# EAGLE design Relay_PCB (EAGLE 9.0.1)
Relay1
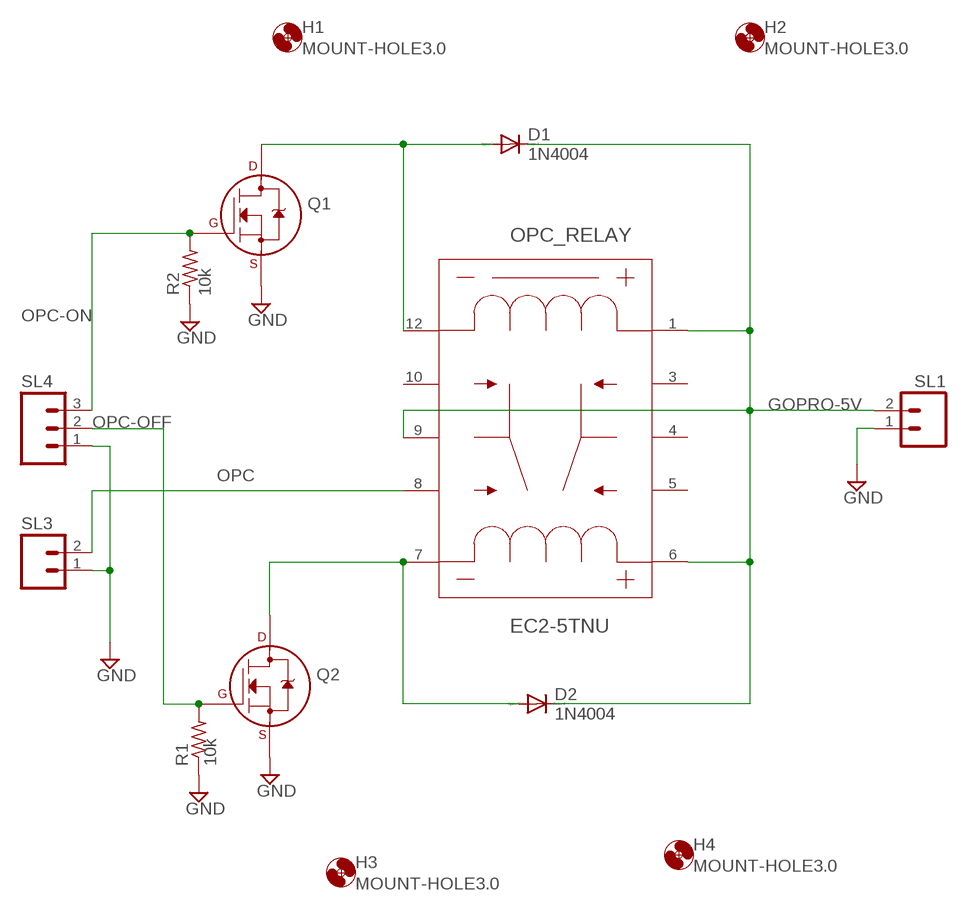
[diagram p0: schematic, sheet 1]

## Parts
D1  1N4004  [DO41-10]
D2  1N4004  [DO41-10]
H1  MOUNT-HOLE3.0  [3,0]
H2  MOUNT-HOLE3.0  [3,0]
H3  MOUNT-HOLE3.0  [3,0]
H4  MOUNT-HOLE3.0  [3,0]
OPC_RELAY  EC2-5TNU  [EC2TNU]
Q1  2N7000_TO92  [TO-92]
Q2  2N7000_TO92  [TO-92]
R1  R-US_0207/7  [0207/7]
R2  R-US_0207/7  [0207/7]
SL1  M02  [02P]
SL3  M02  [02P]
SL4  M03  [03P]

## Nets
GND [5V_Relay]: Q1.1(S) Q2.1(S) R1.1 R2.1 SL1.1 SL3.1 SL4.1
GOPRO-5V [5V_Relay]: D1.C D2.C OPC_RELAY.1 OPC_RELAY.6 OPC_RELAY.9 SL1.2
N$1 [5V_Relay]: D1.A OPC_RELAY.12 Q1.3(D)
N$3 [5V_Relay]: D2.A OPC_RELAY.7 Q2.3(D)
OPC [5V_Relay]: OPC_RELAY.8 SL3.2
OPC-OFF [5V_Relay]: Q2.2(G) R1.2 SL4.2
OPC-ON [5V_Relay]: Q1.2(G) R2.2 SL4.3
Unconnected: OPC_RELAY.3 OPC_RELAY.4 OPC_RELAY.5 OPC_RELAY.10

## Notes on the sheet
- 10k
- 10k

## Library data of the parts
D1 D2 = diode:1N4004: DIODE general purpose rectifier, 1 A
H1-H4 = holes:MOUNT-HOLE: MOUNTING HOLE with drill center marker
OPC_RELAY = EC2-5TNU:EC2-5TNU; MANUFACTURER_PART_NUMBER: EC25TNU; VENDOR: KEMET
Q1 Q2 = transistors:2N700*: 2N7000, 2N7002, NDS7002A N-channel enhancement mode MOSFET
R1 R2 = rcl:R-US_: RESISTOR, American symbol; SPICEPREFIX: R
SL1 SL3 = con-amp-quick:M02: AMP QUICK CONNECTOR; OC_FARNELL: unknown; OC_NEWARK: unknown
SL4 = con-amp-quick:M03: AMP QUICK CONNECTOR; OC_FARNELL: unknown; OC_NEWARK: unknown

## Net classes
1 5V_Relay: width 0.254 mm, drill 0.889 mm, clearance 0.127 mm

## Board
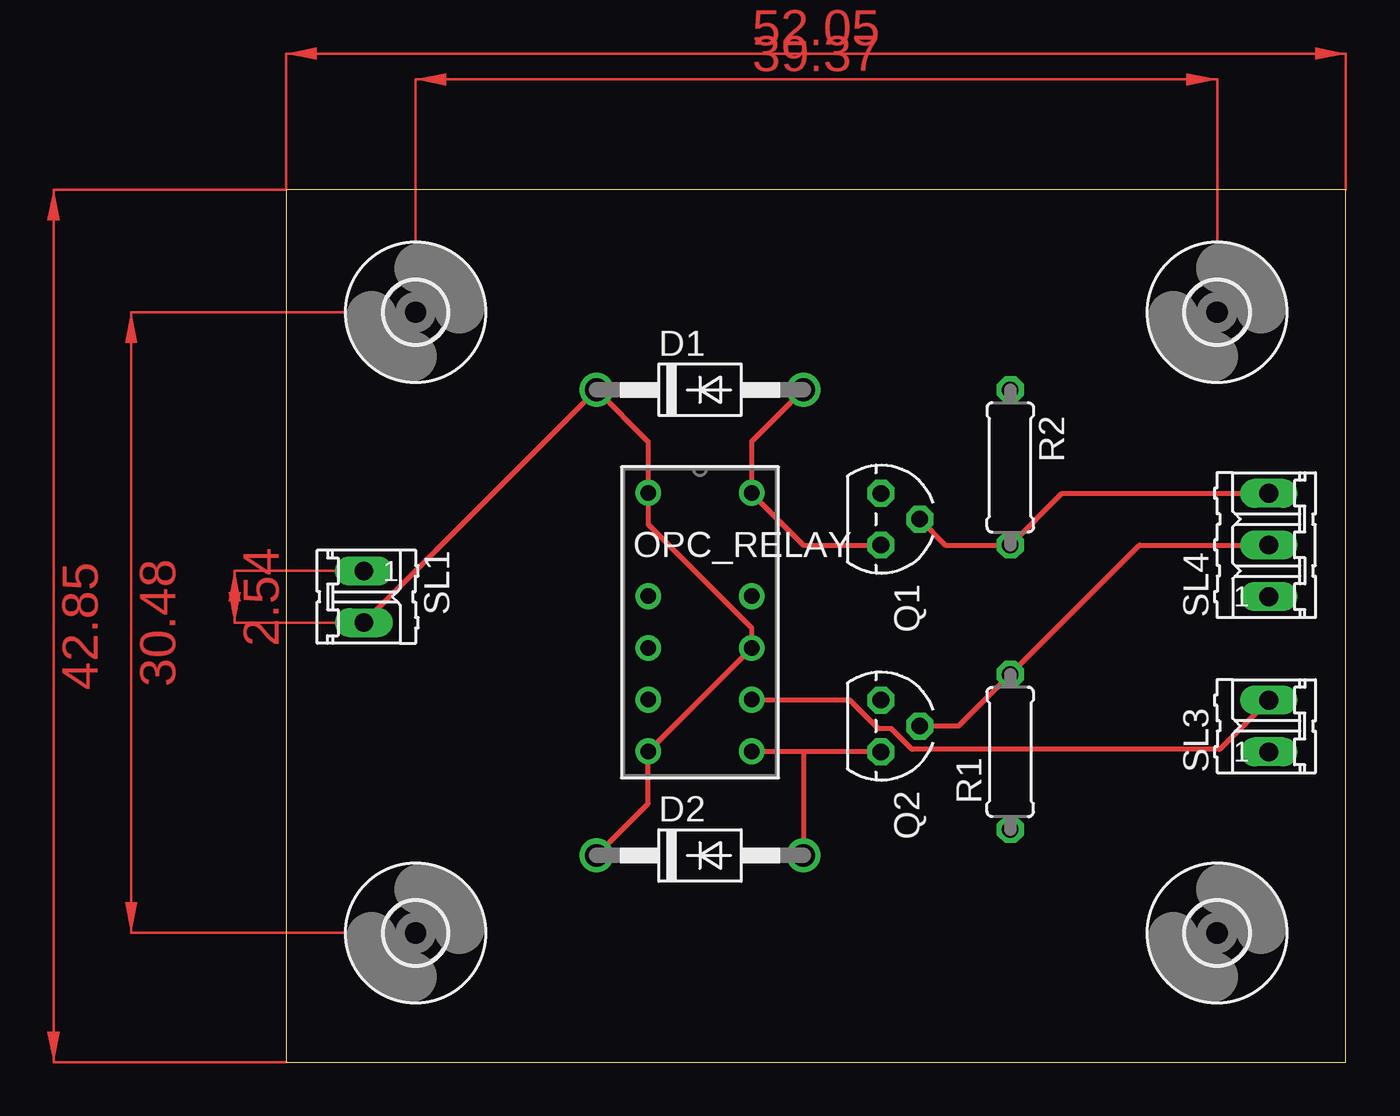
[diagram p1: board, top side]
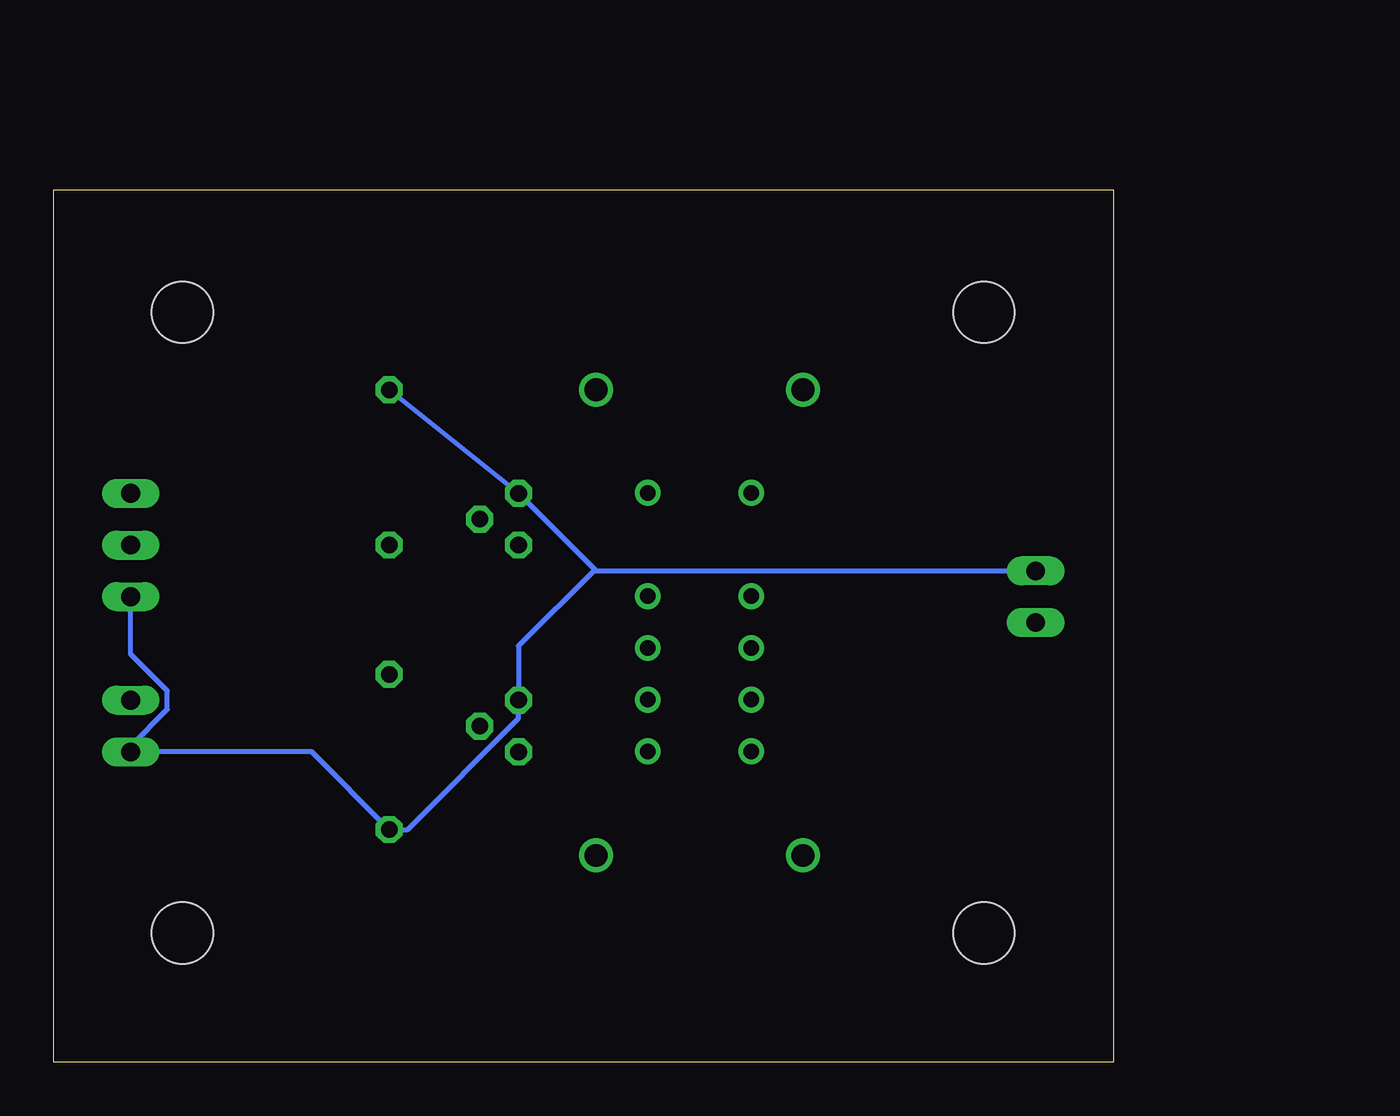
[diagram p2: board, bottom side, seen from below]

Size 52.05 x 42.85 mm. Coordinates in mm from the lower left corner, seen from the top.
Outline: 0,0 52.05,0 52.05,42.85 0,42.85 0,0
Copper layers (1*16): Top 0.035mm / dielectric 1.5mm / Bottom 0.035mm
Design rules "default *": minimum track width 10mil, minimum drill 10mil, track to track 10mil, track to pad 10mil, pad to pad 10mil, via to via 10mil, smd to smd 10mil, copper to edge 40mil, drill to drill 6mil, minimum pad ring 10mil, minimum via ring 8mil, stop-mask expansion 4mil, vias tented up to drill 0mil, thermal gap 10mil

### Footprints (pad centres in the part's own frame; a part is rotated, then mirrored left to right if it is on the bottom)
DO41-10 = drill 1.118: A 5.08,0; C -5.08,0
3,0 = hole 3: 0,0
EC2TNU = drill 0.762 pad 1.27: 1 -2.54,6.375; 3 -2.54,1.295; 4 -2.54,-1.245; 5 -2.54,-3.785; 6 -2.54,-6.325; 7 2.54,-6.325; 8 2.54,-3.785; 9 2.54,-1.245; 10 2.54,1.295; 12 2.54,6.375
TO-92 = drill 0.813 octagon: 1 -1.27,0; 2 0,1.905; 3 1.27,0
0207/7 = drill 0.813 octagon: 1 -3.81,0; 2 3.81,0
02P = drill 0.914 long: 1 -1.27,0; 2 1.27,0
03P = drill 0.914 long: 1 -2.54,0; 2 0,0; 3 2.54,0

### Placement (x,y rotation side)
D1  20.32,33.02 0 top
D2  20.32,10.16 0 top
H1  6.35,6.35 0 top
H2  6.35,36.83 0 top
H3  45.72,36.83 0 top
H4  45.72,6.35 0 top
OPC_RELAY  20.32,21.59 0 top
Q1  29.21,26.67 270 top
Q2  29.21,16.51 270 top
R1  35.56,15.24 90 top
R2  35.56,29.21 270 top
SL1  3.81,22.86 270 top
SL3  48.26,16.51 90 top
SL4  48.26,25.4 90 top

### Tracks (layer width: path | path; a pad name or v marks a point on that pad's centre or on a via)
GND
  Top 0.254: 48.26,15.49 SL3.1
  Bottom 0.254: SL1.1 25.4,24.13 25.46,24.19 | 25.46,24.19 Q1.1 R2.1 | 25.46,24.19 29.21,20.45 Q2.1 29.21,16.89 34.67,11.43 R1.1 39.37,15.24 SL3.1 48.26,15.52 46.46,17.33 46.46,18.23 48.26,20.04 SL4.1
GOPRO-5V
  Top 0.254: 17.78,15.24 17.78,12.7 D2.C | 17.78,15.24 22.86,20.32 OPC_RELAY.9 22.86,21.34 17.78,26.42 OPC_RELAY.1 17.78,30.48 D1.C SL1.2 | 17.78,15.24 OPC_RELAY.6
N$1
  Top 0.254: D1.A 22.86,30.48 OPC_RELAY.12 22.86,27.94 25.4,25.4 Q1.3
N$3
  Top 0.254: Q2.3 25.4,15.24 | 25.4,15.24 22.86,15.24 OPC_RELAY.7 | 25.4,15.24 D2.A
OPC
  Top 0.254: SL3.2 45.85,15.37 30.73,15.37 29.72,16.38 29.08,16.38 27.69,17.78 22.86,17.78 OPC_RELAY.8
OPC-OFF
  Top 0.254: Q2.2 33.02,16.51 R1.2 41.91,25.4 SL4.2
OPC-ON
  Top 0.254: Q1.2 32.38,25.4 R2.2 38.1,27.94 SL4.3
(copper drawn outside any net)
  shapes: Top area x5